# EAGLE design MyOrthotic 2.0000 (EAGLE 7.7.0)
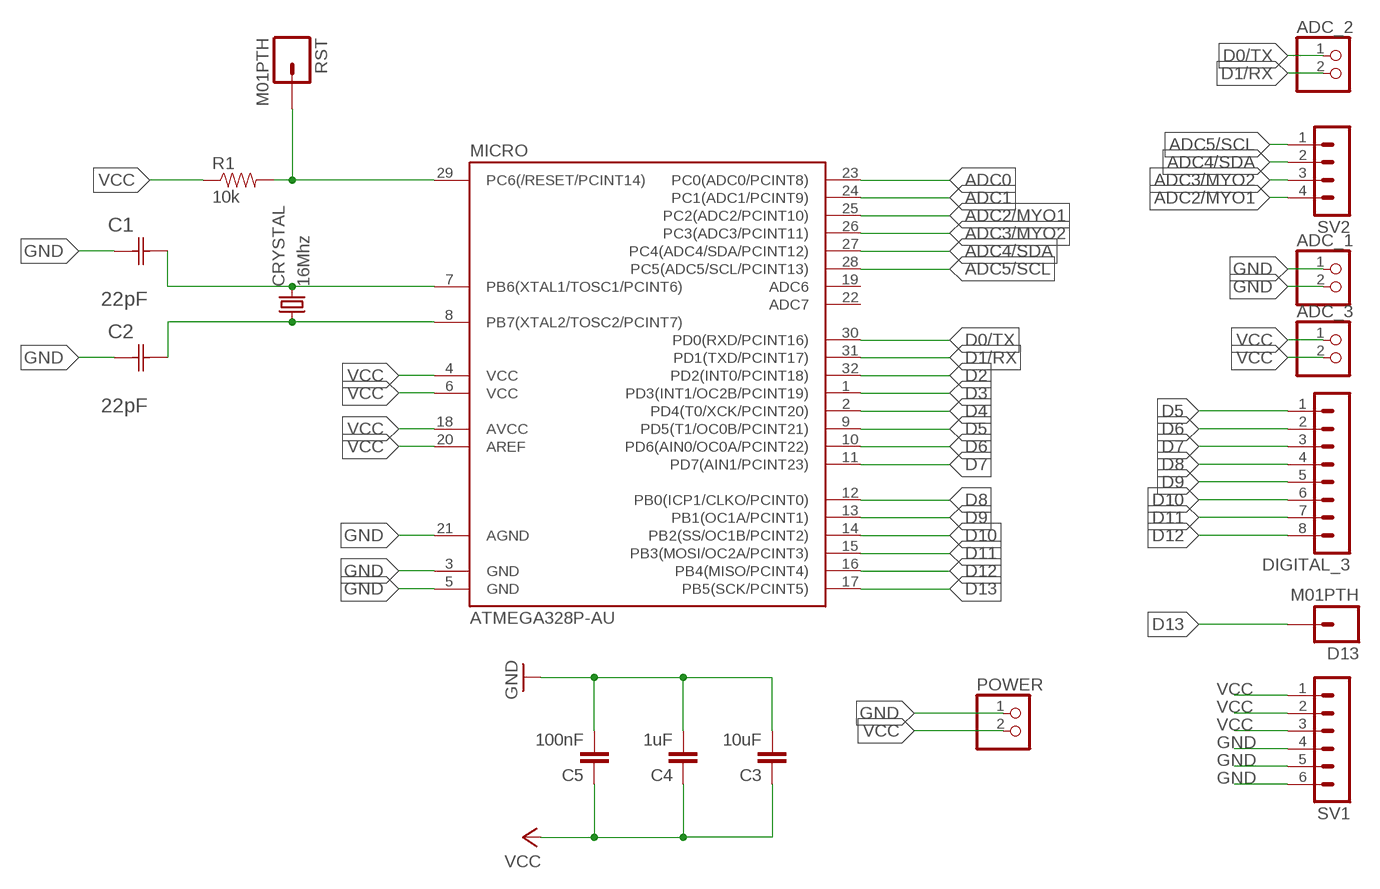
[diagram p0: schematic, sheet 1]

## Parts
ADC_1  PINHD-1X2  [1X02]
ADC_2  PINHD-1X2  [1X02]
ADC_3  PINHD-1X2  [1X02]
C1  22pF  0612ZC225MAT2A  [CAPC3216X178N]
C2  22pF  0612ZC225MAT2A  [CAPC3216X178N]
C3  10uF  CAP1206  [1206]
C4  1uF  CAP1206  [1206]
C5  100nF  CAP1206  [1206]
CRYSTAL  16Mhz  CSM-7X-DU  [CSM-7X-DU]
D13  M01PTH  [1X01]
DIGITAL_3  MA08-1  [MA08-1]
MICRO  ATMEGA328P-AU  ATMEGA48/88/168-AU  [TQFP32-08]
POWER  PINHD-1X2  [1X02]
R1  10k  RESISTOR1206  [1206]
RST  M01PTH  [1X01]
SV1  MA06-1  [MA06-1]
SV2  MA04-1  [MA04-1]

## Nets
ADC0: MICRO.23(PC0(ADC0/PCINT8))
ADC1: MICRO.24(PC1(ADC1/PCINT9))
ADC2/MYO1: MICRO.25(PC2(ADC2/PCINT10)) SV2.4
ADC3/MYO2: MICRO.26(PC3(ADC3/PCINT11)) SV2.3
ADC4/SDA: MICRO.27(PC4(ADC4/SDA/PCINT12)) SV2.2
ADC5/SCL: MICRO.28(PC5(ADC5/SCL/PCINT13)) SV2.1
D0/TX: ADC_2.1 MICRO.30(PD0(RXD/PCINT16))
D1/RX: ADC_2.2 MICRO.31(PD1(TXD/PCINT17))
D2: MICRO.32(PD2(INT0/PCINT18))
D3: MICRO.1(PD3(INT1/OC2B/PCINT19))
D4: MICRO.2(PD4(T0/XCK/PCINT20))
D5: DIGITAL_3.1 MICRO.9(PD5(T1/OC0B/PCINT21))
D6: DIGITAL_3.2 MICRO.10(PD6(AIN0/OC0A/PCINT22))
D7: DIGITAL_3.3 MICRO.11(PD7(AIN1/PCINT23))
D8: DIGITAL_3.4 MICRO.12(PB0(ICP1/CLKO/PCINT0))
D9: DIGITAL_3.5 MICRO.13(PB1(OC1A/PCINT1))
D10: DIGITAL_3.6 MICRO.14(PB2(SS/OC1B/PCINT2))
D11: DIGITAL_3.7 MICRO.15(PB3(MOSI/OC2A/PCINT3))
D12: DIGITAL_3.8 MICRO.16(PB4(MISO/PCINT4))
D13: D13.1 MICRO.17(PB5(SCK/PCINT5))
GND: ADC_1.1 ADC_1.2 C1.1(C1) C2.1(C1) C3.2 C4.2 C5.2 MICRO.3(GND) MICRO.5(GND) MICRO.21(AGND) POWER.1 SV1.4 SV1.5 SV1.6
N$2: C1.2(C2) CRYSTAL.2 MICRO.7(PB6(XTAL1/TOSC1/PCINT6))
N$3: MICRO.29(PC6(/RESET/PCINT14)) R1.2 RST.1
N$9: C2.2(C2) CRYSTAL.1 MICRO.8(PB7(XTAL2/TOSC2/PCINT7))
VCC: ADC_3.1 ADC_3.2 C3.1 C4.1 C5.1 MICRO.4(VCC) MICRO.6(VCC) MICRO.18(AVCC) MICRO.20(AREF) POWER.2 R1.1 SV1.1 SV1.2 SV1.3
Unconnected: MICRO.19(ADC6) MICRO.22(ADC7)

## Library data of the parts
ADC_1-ADC_3 POWER = pinhead:PINHD-1X2: PIN HEADER
C1 C2 = AVX_By_element14_Batch_1:0612ZC225MAT2A: Capacitor 1206; MPN: 0612ZC225MAT2A; OC_FARNELL: -; OC_NEWARK: 12N3209; SUPPLIER: AVX; TOLERANCE: ±20%; VALUE: 2.2µF; VOLTAGERATING: 10V
C3-C5 = 01_SparkFun:CAP: Capacitor Standard 0603 ceramic capacitor, and 0.1" leaded capacitor.
CRYSTAL = 01_FAB_Hello:CSM-7X-DU: SMD CRYSTAL Source: www.ecsxtal.com .. Crystal 3.6864MHz CSM_7X_DU.PDF; OC_FARNELL: unknown; OC_NEWARK: unknown
D13 RST = 01_SparkFun:M01: Header 1 Standard 1-pin 0.1" header. Use with straight break away headers (SKU : PRT-00116), right angle break away headers (PRT-00553), swiss pins (PRT-00743), machine pins (PRT-00117), and female headers (PRT-00115).
DIGITAL_3 = con-lstb:MA08-1: PIN HEADER; OC_FARNELL: unknown; OC_NEWARK: unknown
MICRO = atmega8:ATMEGA48/88/168
R1 = 01_SparkFun:RESISTOR: Resistor Basic schematic elements and footprints for 0603, 1206, and PTH 1/10th watt (small) resistors.
SV1 = con-lstb:MA06-1: PIN HEADER; OC_FARNELL: unknown; OC_NEWARK: unknown
SV2 = con-lstb:MA04-1: PIN HEADER; OC_FARNELL: unknown; OC_NEWARK: unknown

## Board
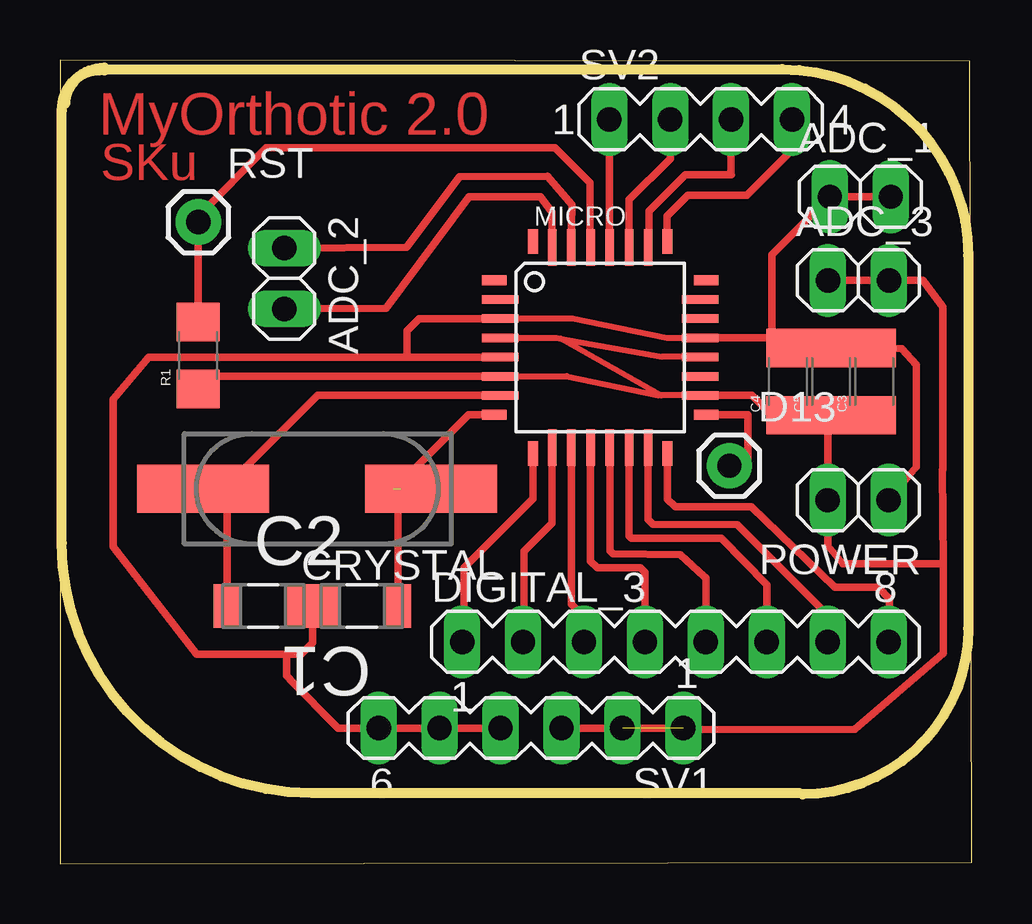
[diagram p1: board, top side]

Size 38.02 x 33.49 mm. Coordinates in mm from the lower left corner, seen from the top.
Outline: 1.71,33.1 30.1,33.1 arc-90 37.86,25.34 37.86,9.8 arc-90 30.95,2.89
Outline: 1.85,33.06 1.62,33.06 arc90 0.22,31.65
Outline: 30.81,2.94 10.49,2.94 arc-90 0.08,13.35 0.08,31.39 arc-90 1.85,33.16
Outline: 0.02,0 38.02,0.05 37.93,33.44 0,33.49 0.02,0
Copper layers (1*16): Top 0.035mm / dielectric 1.5mm / Bottom 0.035mm
Design rules "default": minimum track width 10mil, minimum drill 24mil, track to track 8mil, track to pad 8mil, pad to pad 8mil, via to via 8mil, smd to smd 8mil, copper to edge 40mil, drill to drill 8mil, minimum pad ring 10mil, minimum via ring 8mil, stop-mask expansion 4mil, vias tented up to drill 0mil, thermal gap 10mil

### Footprints (pad centres in the part's own frame; a part is rotated, then mirrored left to right if it is on the bottom)
1X02 = drill 1.016 long: 1 -1.27,0; 2 1.27,0
CAPC3216X178N = smd 1.118 x 1.803: 1 -1.499,0; 2 1.499,0
1206 = smd 1.6 x 1.8: 1 -1.4,0; 2 1.4,0
CSM-7X-DU = smd 5.5 x 2: 1 -4.75,0; 2 4.75,0
1X01 = drill 1.016 pad 1.88: 1 0,0
MA08-1 = drill 1.016 long: 1 -8.89,0; 2 -6.35,0; 3 -3.81,0; 4 -1.27,0; 5 1.27,0; 6 3.81,0; 7 6.35,0; 8 8.89,0
TQFP32-08 = smd 1.016 x 0.406: 1 -4.42,2.8; 8 -4.42,-2.8; 17 4.42,-2.8; 24 4.42,2.8 | smd 1.524 x 0.356: 2 -4.166,2; 3 -4.166,1.2; 4 -4.166,0.4; 5 -4.166,-0.4; 6 -4.166,-1.2; 7 -4.166,-2; 18 4.166,-2; 19 4.166,-1.2; 20 4.166,-0.4; 21 4.166,0.4; 22 4.166,1.2; 23 4.166,2 | smd 0.406 x 1.016: 9 -2.8,-4.42; 16 2.8,-4.42; 25 2.8,4.42; 32 -2.8,4.42 | smd 0.356 x 1.524: 10 -2,-4.166; 11 -1.2,-4.166; 12 -0.4,-4.166; 13 0.4,-4.166; 14 1.2,-4.166; 15 2,-4.166; 26 2,4.166; 27 1.2,4.166; 28 0.4,4.166; 29 -0.4,4.166; 30 -1.2,4.166; 31 -2,4.166
MA06-1 = drill 1.016 long: 1 -6.35,0; 2 -3.81,0; 3 -1.27,0; 4 1.27,0; 5 3.81,0; 6 6.35,0
MA04-1 = drill 1.016 long: 1 -3.81,0; 2 -1.27,0; 3 1.27,0; 4 3.81,0

### Placement (x,y rotation side)
ADC_1  33.37,27.79 0 top
ADC_2  9.35,24.38 270 top
ADC_3  33.29,24.31 0 top
C1  8.47,10.74 180 top
C2  12.59,10.74 0 top
C3  33.95,20.09 90 top
C4  30.34,20.09 90 top
C5  32.15,20.09 90 top
CRYSTAL  10.73,15.62 180 top
D13  27.9,16.58 0 top
DIGITAL_3  25.65,9.24 0 top
MICRO  22.52,21.51 0 top
POWER  33.27,15.15 180 top
R1  5.76,21.18 90 top
RST  5.77,26.74 0 top
SV1  19.63,5.65 180 top
SV2  26.71,31.01 0 top

### Tracks (layer width: path | path; a pad name or v marks a point on that pad's centre or on a via)
ADC2/MYO1
  Top 0.305: MICRO.25 25.31,25.94 25.31,26.97 26.18,27.85 28.64,27.85 30.52,29.73 SV2.4
ADC3/MYO2
  Top 0.305: MICRO.26 24.55,25.71 24.55,27.18 26.08,28.71 27.98,28.71 SV2.3
ADC4/SDA
  Top 0.305: MICRO.27 23.73,27.67 25.44,29.37 SV2.2
ADC5/SCL
  Top 0.305: MICRO.28 22.9,25.7 SV2.1
D0/TX
  Top 0.305: MICRO.30 21.3,25.69 21.34,27.45 20.32,28.65 16.65,28.63 14.44,25.69 ADC_2.1
D1/RX
  Top 0.305: MICRO.31 20.52,27.14 20.02,27.79 17.06,27.79 13.58,23.14 ADC_2.2
D5
  Top 0.305: MICRO.9 19.72,15.21 16.84,12.32 16.84,10.31 DIGITAL_3.1
D6
  Top 0.305: MICRO.10 20.52,14.18 19.35,13.01 19.35,10.28 DIGITAL_3.2
D7
  Top 0.305: MICRO.11 21.32,10.81 21.84,10.29 DIGITAL_3.3
D8
  Top 0.305: MICRO.12 22.12,12.6 22.4,12.32 24.2,12.32 24.38,12.15 24.38,10.29 DIGITAL_3.4
D9
  Top 0.305: MICRO.13 22.92,13.05 23.06,12.91 25.85,12.88 26.87,11.96 26.92,11.91 DIGITAL_3.5
D10
  Top 0.305: MICRO.14 23.72,13.67 23.82,13.57 27.56,13.57 29.46,11.62 29.46,10.35 DIGITAL_3.6
D11
  Top 0.305: MICRO.15 24.52,14.34 24.71,14.15 28.23,14.13 32,10.36 DIGITAL_3.7
D12
  Top 0.305: MICRO.16 25.32,15.19 25.65,14.86 28.83,14.86 32.3,11.51 34.12,11.51 34.56,11.03 34.56,10.27 DIGITAL_3.8
D13
  Top 0.305: MICRO.17 28.67,18.71 28.67,16.57 27.9,16.57 D13.1
GND
  Top 0.254: MICRO.21 26.67,21.9 25.31,21.89 21.37,22.71 MICRO.3
  Top 0.305: MICRO.21 29.68,21.91 | MICRO.5 14.5,21.11 | 14.5,21.11 3.71,21.11 2.21,19.35 2.21,13.21 5.71,8.72 9.44,8.72 | 9.44,8.72 10.05,8.72 10.54,9.2 10.54,10.7 | 10.54,10.7 10.51,10.72 9.97,10.72 C1.1 | 10.54,10.7 11.09,10.7 C2.1 | 29.68,21.91 29.92,21.91 C4.2 C5.2 C3.2 35.09,21.45 35.69,20.79 35.69,16.53 POWER.1 | MICRO.3 14.98,22.71 14.47,22.2 14.47,21.13 14.5,21.11 | ADC_1.2 ADC_1.1 29.68,25.37 29.68,21.91 | SV1.4 SV1.5 SV1.6 | SV1.6 | SV1.6 11.6,5.65 9.59,7.66 9.59,7.68 9.44,7.83 9.44,8.72
N$2
  Top 0.254: 6.98,15.03 6.62,15.39 6.21,15.39 CRYSTAL.2
  Top 0.305: MICRO.7 10.74,19.51 6.62,15.39 | C1.2 6.98,15.03
N$3
  Top 0.305: 5.73,22.58 R1.2 5.76,26.72 RST.1 | 5.76,26.75 RST.1 | MICRO.29 22.1,25.69 22.1,28.37 20.65,29.82 8.6,29.82 5.77,27 RST.1
N$9  (2 unrouted)
  Top 0.305: MICRO.8 17.03,18.71 13.9,15.58 13.9,15.62 CRYSTAL.1 | C2.2 14.09,15.62
VCC  (1 unrouted)
  Top 0.254: MICRO.20 26.08,21.11 26.08,21.13 25.11,21.13 20.88,21.88 | MICRO.4 20.7,21.91 20.88,21.88 | MICRO.6 | 19.04,20.31 21.12,20.31 24.94,19.51 MICRO.18 | MICRO.18 25.06,19.51 20.88,21.88
  Top 0.305: 26.69,19.5 MICRO.18 | MICRO.20 26.08,21.13 | 26.69,19.48 MICRO.18 | 19.04,20.31 MICRO.6 | MICRO.6 5.76,20.31 R1.1 | C5.1 C4.1 30.38,18.65 30.96,18.65 30.93,18.67 29.68,18.67 28.84,19.52 MICRO.18 | C5.1 32,18.54 POWER.2 32.01,13.24 32.63,12.5 36.83,12.5 | C5.1 C3.1 | ADC_3.1 ADC_3.2 35.97,24.32 36.8,23.2 36.8,16.42 36.79,16.41 36.83,12.5 | SV1.3 SV1.1 26.06,5.58 33.13,5.6 36.82,8.76 36.83,12.5

### Text on the board
Top: MyOrthotic 2.0 | SKu